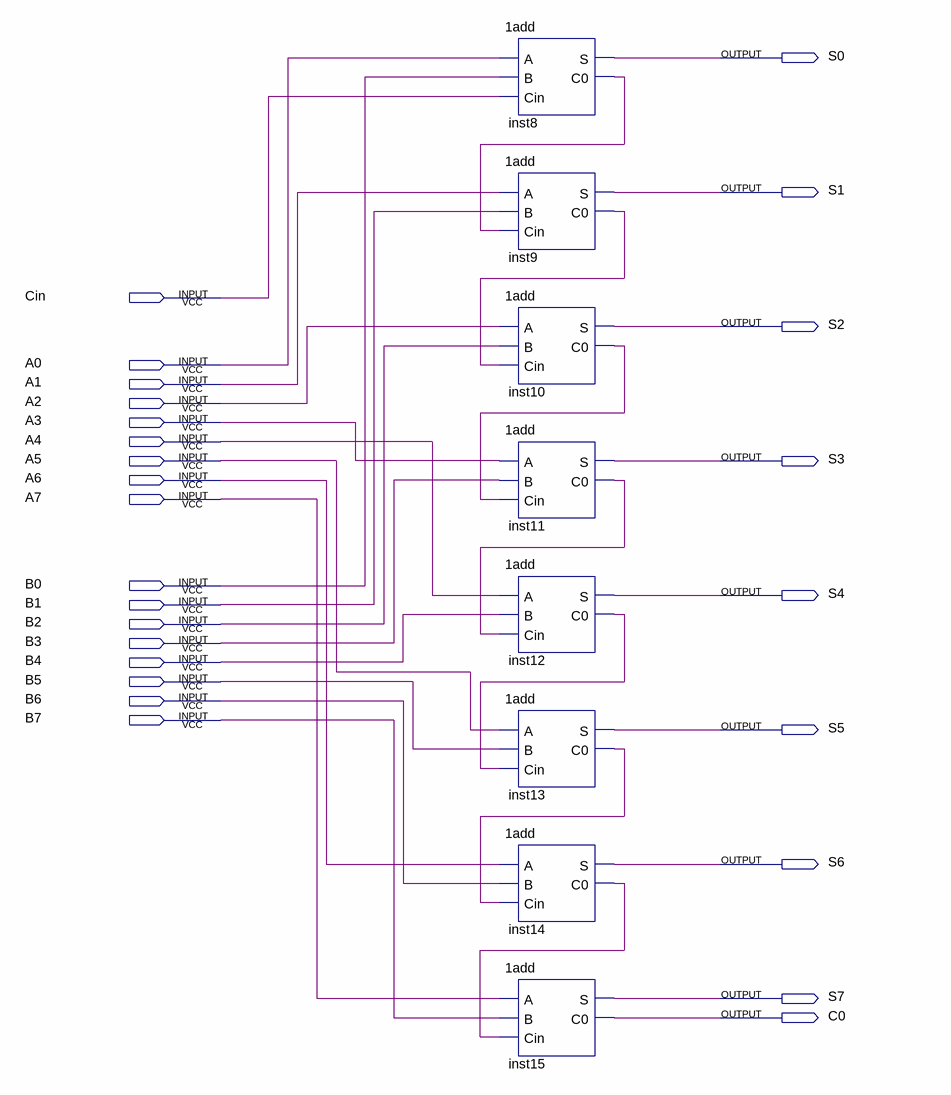
[diagram p0: schematic sheet]
// Quartus schematic 8add.bdf as structural Verilog: 8 symbols, 26 pins
module \8add  (
  input  Cin,
  input  A0,
  input  A1,
  input  A2,
  input  A3,
  input  A4,
  input  A5,
  input  A6,
  input  A7,
  input  B0,
  input  B1,
  input  B2,
  input  B3,
  input  B4,
  input  B5,
  input  B6,
  input  B7,
  output S0,
  output S1,
  output S2,
  output S3,
  output S4,
  output S5,
  output S6,
  output S7,
  output C0
);

  wire inst8_c0, inst9_c0, inst10_c0, inst11_c0, inst12_c0, inst13_c0, inst14_c0;

  \1add  inst8 (.A(A0), .B(B0), .Cin(Cin), .S(S0), .C0(inst8_c0));
  \1add  inst9 (.A(A1), .B(B1), .Cin(inst8_c0), .S(S1), .C0(inst9_c0));
  \1add  inst10 (.A(A2), .B(B2), .Cin(inst9_c0), .S(S2), .C0(inst10_c0));
  \1add  inst11 (.A(A3), .B(B3), .Cin(inst10_c0), .S(S3), .C0(inst11_c0));
  \1add  inst12 (.A(A4), .B(B4), .Cin(inst11_c0), .S(S4), .C0(inst12_c0));
  \1add  inst13 (.A(A5), .B(B5), .Cin(inst12_c0), .S(S5), .C0(inst13_c0));
  \1add  inst14 (.A(A6), .B(B6), .Cin(inst13_c0), .S(S6), .C0(inst14_c0));
  \1add  inst15 (.A(A7), .B(B7), .Cin(inst14_c0), .S(S7), .C0(C0));
endmodule
